# Altium project INTEGRATION ! Omega Blade PCB and Schematic.PrjPcb
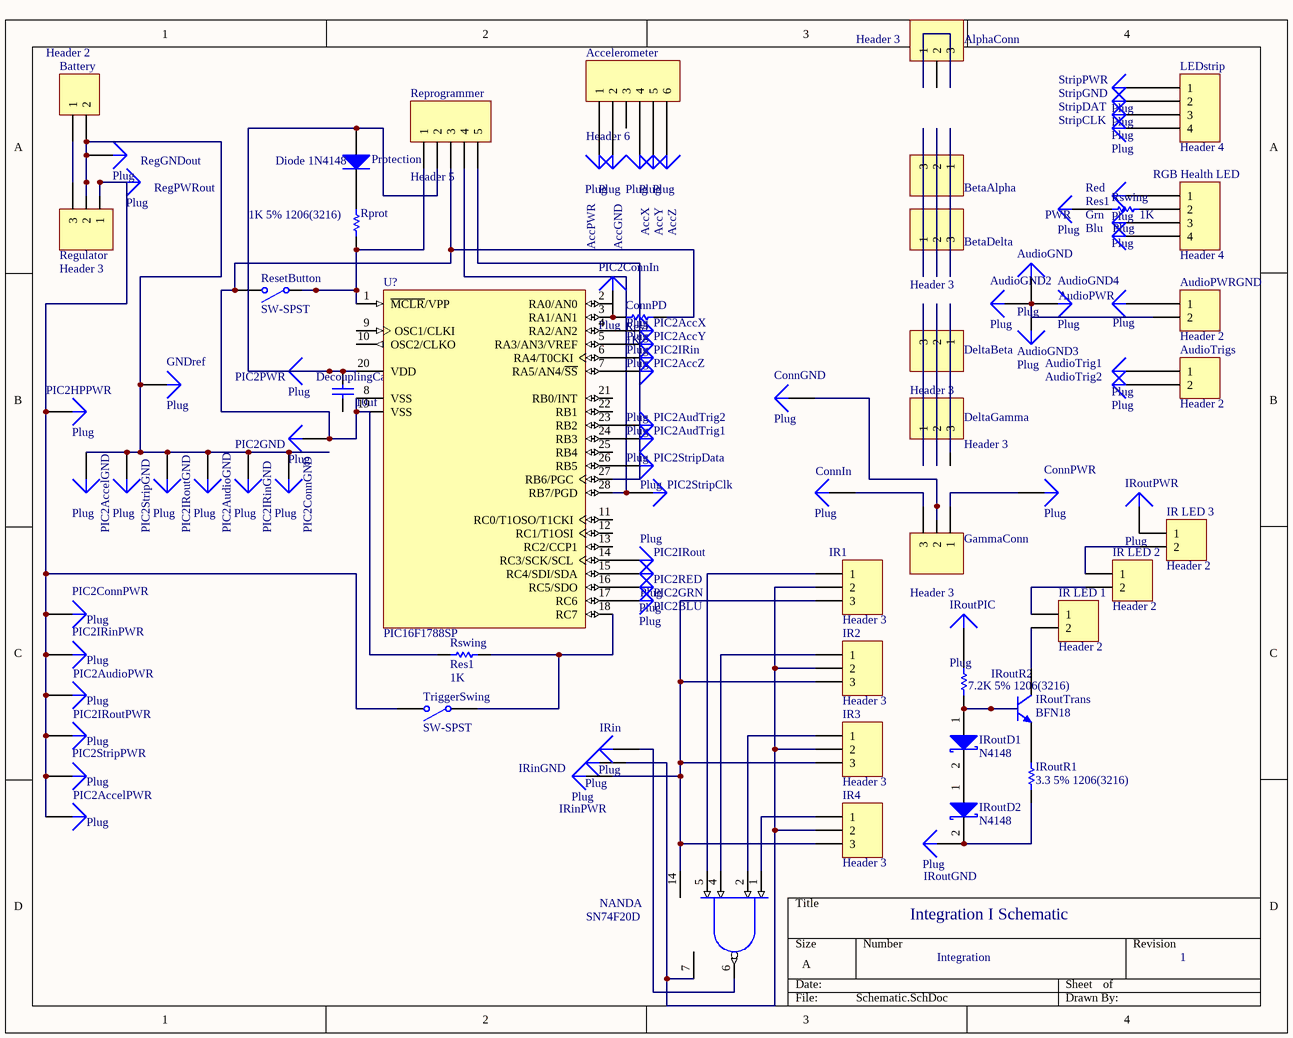
[diagram p0: Schematic.SchDoc]
1 sheet, 96 parts. Net scope: global (net labels, ports and power ports of the same name join across sheets).
Board files: PCB1.PcbDoc, PCB2.PcbDoc

## Sheet Schematic.SchDoc
size A

### Parts
(Parts that share a designator on the sheet are numbered #1, #2 ... from top to bottom, then left to right.)
Accelerometer  Header 6  [HDR1X6]
AccGND  Plug  [PIN1]
AccPWR  Plug  [PIN1]
AccX  Plug  [PIN1]
AccY  Plug  [PIN1]
AccZ  Plug  [PIN1]
AlphaConn  Header 3  [HDR1X3]
AudioGND  Plug  [PIN1]
AudioGND2  Plug  [PIN1]
AudioGND3  Plug  [PIN1]
AudioGND4  Plug  [PIN1]
AudioPWR  Plug  [PIN1]
AudioPWRGND  Header 2  [HDR1X2]
AudioTrig1  Plug  [PIN1]
AudioTrig2  Plug  [PIN1]
AudioTrigs  Header 2  [HDR1X2]
Battery  Header 2  [HDR1X2]
BetaAlpha  Header 3  [HDR1X3]
BetaDelta  Header 3  [HDR1X3]
Blu  Plug  [PIN1]
ConnGND  Plug  [PIN1]
ConnIn  Plug  [PIN1]
ConnPD  Res1  value 1K  [AXIAL-0.3]
ConnPWR  Plug  [PIN1]
DecouplingCap  10uf  [CAPC0805(2012)75_L]
DeltaBeta  Header 3  [HDR1X3]
DeltaGamma  Header 3  [HDR1X3]
GammaConn  Header 3  [HDR1X3]
GNDref  Plug  [PIN1]
Grn  Plug  [PIN1]
IR1  Header 3  [HDR1X3]
IR2  Header 3  [HDR1X3]
IR3  Header 3  [HDR1X3]
IR4  Header 3  [HDR1X3]
IR_LED_1  Header 2  [HDR1X2]
IR_LED_2  Header 2  [HDR1X2]
IR_LED_3  Header 2  [HDR1X2]
IRin  Plug  [PIN1]
IRinGND  Plug  [PIN1]
IRinPWR  Plug  [PIN1]
IRoutD1  N4148  [DIOD-SOD323-2_V]
IRoutD2  N4148  [DIOD-SOD323-2_V]
IRoutGND  Plug  [PIN1]
IRoutPIC  Plug  [PIN1]
IRoutPWR  Plug  [PIN1]
IRoutR1  3.3 5% 1206(3216)  [RESC1206(3216)_N]
IRoutR2  7.2K 5% 1206(3216)  [RESC1206(3216)_N]
IRoutTrans  BFN18  [INF-SOT89_SC-62_M]
LEDstrip  Header 4  [HDR1X4]
NAND  SN74F20D  [D014_M]  (part A of 2)
PIC2AccelGND  Plug  [PIN1]
PIC2AccelPWR  Plug  [PIN1]
PIC2AccX  Plug  [PIN1]
PIC2AccY  Plug  [PIN1]
PIC2AccZ  Plug  [PIN1]
PIC2AudioGND  Plug  [PIN1]
PIC2AudioPWR  Plug  [PIN1]
PIC2AudTrig1  Plug  [PIN1]
PIC2AudTrig2  Plug  [PIN1]
PIC2BLU  Plug  [PIN1]
PIC2ConnGND  Plug  [PIN1]
PIC2ConnIn  Plug  [PIN1]
PIC2ConnPWR  Plug  [PIN1]
PIC2GND  Plug  [PIN1]
PIC2GRN  Plug  [PIN1]
PIC2HPPWR  Plug  [PIN1]
PIC2IRin  Plug  [PIN1]
PIC2IRinGND  Plug  [PIN1]
PIC2IRinPWR  Plug  [PIN1]
PIC2IRout  Plug  [PIN1]
PIC2IRoutGND  Plug  [PIN1]
PIC2IRoutPWR  Plug  [PIN1]
PIC2PWR  Plug  [PIN1]
PIC2RED  Plug  [PIN1]
PIC2StripClk  Plug  [PIN1]
PIC2StripData  Plug  [PIN1]
PIC2StripGND  Plug  [PIN1]
PIC2StripPWR  Plug  [PIN1]
Protection  Diode 1N4148  [DO-35]
PWR  Plug  [PIN1]
Red  Plug  [PIN1]
RegGNDout  Plug  [PIN1]
RegPWRout  Plug  [PIN1]
Regulator  Header 3  [HDR1X3]
Reprogrammer  Header 5  [HDR1X5]
ResetButton  SW-SPST  [SPST-2]
RGB_Health_LED  Header 4  [HDR1X4]
Rprot  1K 5% 1206(3216)  [RESC1206(3216)_N]
Rswing#1  Res1  value 1K  [AXIAL-0.3]
Rswing#2  Res1  value 1K  [AXIAL-0.3]
StripCLK  Plug  [PIN1]
StripDAT  Plug  [PIN1]
StripGND  Plug  [PIN1]
StripPWR  Plug  [PIN1]
TriggerSwing  SW-SPST  [SPST-2]
U?  PIC16F1788SP  [SPDIP300-SP28]

### Nets
GND: IR1.2 IR2.2 IR3.2 IR4.2 IRinGND.1 NAND.7(GND)
VCC: IR1.3 IR2.3 IR3.3 IR4.3 IRinPWR.1 NAND.14(VCC)
NetAccelerometer_1: Accelerometer.1 AccPWR.1
NetAccelerometer_2: Accelerometer.2 AccGND.1
NetAccelerometer_4: Accelerometer.4 AccX.1
NetAccelerometer_5: Accelerometer.5 AccY.1
NetAccelerometer_6: Accelerometer.6 AccZ.1
NetAlphaConn_1: AlphaConn.1 AlphaConn.3
NetAudioGND_1: AudioGND.1 AudioGND2.1 AudioGND3.1 AudioGND4.1 AudioPWRGND.2
NetAudioPWR_1: AudioPWR.1 AudioPWRGND.1
NetAudioTrig1_1: AudioTrig1.1 AudioTrigs.1
NetAudioTrig2_1: AudioTrig2.1 AudioTrigs.2
NetBattery_1: Battery.1 Regulator.3
NetBattery_2: Battery.2 GNDref.1 PIC2AccelGND.1 PIC2AudioGND.1 PIC2ConnGND.1 PIC2IRinGND.1 PIC2IRoutGND.1 PIC2StripGND.1 RegGNDout.1 Regulator.2
NetBetaAlpha_1: BetaAlpha.1 BetaDelta.3
NetBetaAlpha_2: BetaAlpha.2 BetaDelta.2
NetBetaAlpha_3: BetaAlpha.3 BetaDelta.1
NetBlu_1: Blu.1 RGB_Health_LED.4
NetConnGND_1: ConnGND.1 GammaConn.2
NetConnIn_1: ConnIn.1 GammaConn.3
NetConnPD_1: ConnPD.1 PIC2GND.1 Reprogrammer.3 ResetButton.2(NO) Rswing#2.2 U?.8(VSS) U?.19(VSS)
NetConnPD_2: ConnPD.2 PIC2ConnIn.1 U?.3(RA1/AN1)
NetConnPWR_1: ConnPWR.1 GammaConn.1
NetDecouplingCap_1: DecouplingCap.1 PIC2PWR.1 Protection.1(A) Reprogrammer.2 U?.20(VDD)
NetDeltaBeta_2: DeltaBeta.2 DeltaGamma.2
NetDeltaBeta_3: DeltaBeta.3 DeltaGamma.1
NetGrn_1: Grn.1 RGB_Health_LED.3
NetIR1_1: IR1.1 NAND.5(D)
NetIR2_1: IR2.1 NAND.4(C)
NetIR3_1: IR3.1 NAND.2(B)
NetIR4_1: IR4.1 NAND.1(A)
NetIR_LED_1_1: IR_LED_1.1 IR_LED_2.2
NetIR_LED_1_2: IR_LED_1.2 IRoutTrans.2(C)
NetIR_LED_2_1: IR_LED_2.1 IR_LED_3.2
NetIR_LED_3_1: IR_LED_3.1 IRoutPWR.1
NetIRin_1: IRin.1 NAND.6(Y)
NetIRoutD1_1: IRoutD1.1(A) IRoutR2.1 IRoutTrans.1(B)
NetIRoutD1_2: IRoutD1.2(K) IRoutD2.1(A)
NetIRoutD2_2: IRoutD2.2(K) IRoutGND.1 IRoutR1.1
NetIRoutPIC_1: IRoutPIC.1 IRoutR2.2
NetIRoutR1_2: IRoutR1.2 IRoutTrans.3(E)
NetLEDstrip_1: LEDstrip.1 StripPWR.1
NetLEDstrip_2: LEDstrip.2 StripGND.1
NetLEDstrip_3: LEDstrip.3 StripDAT.1
NetLEDstrip_4: LEDstrip.4 StripCLK.1
NetPIC2AccelPWR_1: PIC2AccelPWR.1 PIC2AudioPWR.1 PIC2ConnPWR.1 PIC2HPPWR.1 PIC2IRinPWR.1 PIC2IRoutPWR.1 PIC2StripPWR.1 RegPWRout.1 Regulator.1 TriggerSwing.2(NO)
NetPIC2AccX_1: PIC2AccX.1 U?.4(RA2/AN2)
NetPIC2AccY_1: PIC2AccY.1 U?.5(RA3/AN3/VREF)
NetPIC2AccZ_1: PIC2AccZ.1 U?.7(RA5/AN4/~{SS})
NetPIC2AudTrig1_1: PIC2AudTrig1.1 U?.24(RB3)
NetPIC2AudTrig2_1: PIC2AudTrig2.1 U?.23(RB2)
NetPIC2BLU_1: PIC2BLU.1 U?.17(RC6)
NetPIC2GRN_1: PIC2GRN.1 U?.16(RC5/SDO)
NetPIC2IRin_1: PIC2IRin.1 U?.6(RA4/T0CKI)
NetPIC2IRout_1: PIC2IRout.1 U?.14(RC3/SCK/SCL)
NetPIC2RED_1: PIC2RED.1 U?.15(RC4/SDI/SDA)
NetPIC2StripClk_1: PIC2StripClk.1 Reprogrammer.4 U?.28(RB7/PGD)
NetPIC2StripData_1: PIC2StripData.1 U?.26(RB5)
NetProtection_2: Protection.2(K) Rprot.2
NetPWR_1: PWR.1 Rswing#1.2
NetRed_1: Red.1 RGB_Health_LED.1
NetReprogrammer_1: Reprogrammer.1 ResetButton.1(COMMON) Rprot.1 U?.1(~{MCLR}/VPP)
NetReprogrammer_5: Reprogrammer.5 U?.27(RB6/PGC)
NetRGB_Health_LED_2: RGB_Health_LED.2 Rswing#1.1
NetRswing#2_1: Rswing#2.1 TriggerSwing.1(COMMON) U?.18(RC7)

Not connected (* = marked no-connect by the designer): Accelerometer 3; AlphaConn 2; DecouplingCap 2; DeltaBeta 1; DeltaGamma 3; U? 2(RA0/AN0) 9(OSC1/CLKI) 10(OSC2/CLKO) 11(RC0/T1OSO/T1CKI) 12(RC1/T1OSI) 13(RC2/CCP1) 21(RB0/INT) 22(RB1) 25(RB4)

### Notes on the sheet
- Integration I Schematic
- Integration
- 1

### Library data of the parts
Accelerometer = Header 6: Header, 6-Pin; LatestRevisionDate: 17-Jul-2002; LatestRevisionNote: Re-released for DXP Platform.; Publisher: Altium Limited
AlphaConn BetaAlpha BetaDelta DeltaBeta DeltaGamma GammaConn IR1-IR4 Regulator = Header 3: Header, 3-Pin; LatestRevisionDate: 17-Jul-2002; LatestRevisionNote: Re-released for DXP Platform.; Publisher: Altium Limited
AudioPWRGND AudioTrigs Battery IR_LED_1-IR_LED_3 = Header 2: Header, 2-Pin; LatestRevisionDate: 17-Jul-2002; LatestRevisionNote: Re-released for DXP Platform.; Publisher: Altium Limited
ConnPD Rswing#1 Rswing#2 = Res1: Resistor; Published: 8-Jun-2000; LatestRevisionDate: 17-Jul-2002; LatestRevisionNote: Re-released for DXP Platform.; PackageReference: AXIAL-0.3; Publisher: Altium Limited; PackageDescription: Axial Device, Thru-Hole; 2 Leads; 0.3 in Pin Spacing
DecouplingCap = CMP-1036-01219-1: CAP 22pF 16V Â±5% 0805 (2012 Metric) Thickness 0.75mm SMD; Case-Metric: 2012; Case-EIA: 0805; Technology: SMT; Max Thickness: 0.75 mm; Value: 22pF; Tolerance: Â±5%; Rated Voltage: 16 V
IRoutD1 IRoutD2 = CMP-0303-00001-1: Schottky Diode, 400mA; PartNumber: ZHCS400; Manufacturer: Diodes Inc; Reverse Voltage: 40 V; Power Dissipation: 250 mW; Reverse Current: 40 uA@Vr=30 V; Packing Type: Tape and Reel; Forward Voltage: 425 mV@If=400 mA; ComponentLink3URL: http://www.diodes.com/datasheets/ap02002.pdf; Moisture Sensitivity Level: 1; ComponentLink2URL: http://www.diodes.com/datasheets/ZHCS400.pdf; PackageDescription: 2-Pin SMT Diode, 1.7 x 1.3 mm Body; ComponentLink2Description: Datasheet; PackageReference: SOD323; ComponentLink1Description: Manufacturer URL; Mounting Technology: Surface Mount; DatasheetVersion: Rev. 8-2, 03/2012; ComponentLink1URL: http://www.diodes.com/; Storage Temperature: -55 to 150 degC; ComponentLink3Description: Package Specification; PackageVersion: Rev. 73
IRoutR1 IRoutR2 Rprot = CMP-1014-00074-1: 1K 0.25W 5% 1206 (3216 Metric)  SMD; Value: 1000.00 Ohm; Case-Metric: 3216; Case-EIA: 1206; Tolerance: 5 %; Power: 0.25 W; Technology: SMT
IRoutTrans = CMP-1197-00012-1: NPN Silicon High-Voltage Transistor, 300 V VCEO, 30 mA IC, SOT89, Reel, Green; Manufacturer: Infineon; ICM (max): 500Â mA; ICBO (max): 100Â nA; VEBO (max): 5Â V; VCE: 10Â V; VCBO (max): 300Â V; hFE (min): 30; IC (max): 30Â mA; Green: TRUE; fT (typ): 70Â MHz; ComponentLink3URL: http://www.infineon.com/dgdl/SOT89-Package_Overview.pdf?folderId=db3a30431936bc4b01195371b8363cff&fileId=db3a30431936bc4b0119537ed61d3d22; DatasheetVersion: Rev. 1.0; ComponentLink2URL: http://www.infineon.com/dgdl/bfn18.pdf?folderId=db3a30431441fb5d011449af3ad90232&fileId=db3a30431441fb5d011449b188060234; ComponentLink1Description: Manufacturer URL; VCE (max): 10Â V; Mounting Technology: Surface Mount; ComponentLink1URL: http://www.infineon.com/; Packing: Reel; Polarity: NPN; PackageDescription: 3-Pin Small Outline Transistor Package, 4.5 x 2.5 mm Body, 1.5 mm Pitch; ComponentLink3Description: Package Specification; ComponentLink2Description: Datasheet; PartNumber: BFN18; PackageVersion: Apr-08; PackageReference: SOT89 (SC-62); IC: 30Â mA; VCEO (max): 300Â V
LEDstrip RGB_Health_LED = Header 4: Header, 4-Pin; LatestRevisionDate: 17-Jul-2002; LatestRevisionNote: Re-released for DXP Platform.; Publisher: Altium Limited
NAND = SN74F20D: Dual 4-Input Positive-NAND Gate; Note: Pins 3 and 11 are NC & not drawn.; Published: 8-Jun-2000; LatestRevisionDate: 13-Apr-2006; LatestRevisionNote: IPC-7351 Footprint Added.; DatasheetVersion: Oct-1993; PackageVersion: Jan-1998; PackageReference: D014; Publisher: Altium Limited; PackageDescription: 14-Pin Small Outline Integrated Circuit 1.27 mm Pitch; Code_IPC: SOIC127P600-14; ComponentLink1Description: Manufacturer Link; ComponentLink1URL: http://www.ti.com/; ComponentLink2Description: Datasheet; ComponentLink2URL: http://www-s.ti.com/sc/ds/SN54F20.pdf
Protection = Diode 1N4148: High Conductance Fast Diode; Published: 8-Jun-2000; LatestRevisionDate: 17-Jul-2002; LatestRevisionNote: Re-released for DXP Platform.; DatasheetVersion: 1997; PackageReference: DO-35; Publisher: Altium Limited; PackageDescription: Diode, Axial; Body 3.8 x 1.9 mm (LxDia. max), Lead Dia. 0.53 mm (max); Code_JEDEC: DO-204-AH; ComponentLink1Description: Manufacturer Link; ComponentLink1URL: http://www.fairchildsemi.com/; ComponentLink2Description: Datasheet; ComponentLink2URL: http://www.fairchildsemi.com/ds/1N%2F1N4148.pdf
Reprogrammer = Header 5: Header, 5-Pin; LatestRevisionDate: 17-Jul-2002; LatestRevisionNote: Re-released for DXP Platform.; Publisher: Altium Limited
ResetButton TriggerSwing = SW-SPST: Single-Pole, Single-Throw Switch; Published: 24-Mar-1999; LatestRevisionDate: 17-Jul-2002; LatestRevisionNote: Re-released for DXP Platform.; PackageReference: SPST-2; Publisher: Altium Limited; PackageDescription: Switch; 2 Leads
U? = PIC16F72-I/SP: 8-Bit CMOS FLASH Microcontroller with A/D Converter, 2K (x14-Bit words) FLASH, 128 Bytes RAM, 28-Pin PDIP 300mil, Standard VDD Range, Industrial Temperature; Published: 11-Oct-2004; LatestRevisionDate: 29-Jan-2009; LatestRevisionNote: Sch. layout revised. 3D Model Removed.; DatasheetVersion: revC, Jan-2007; PackageVersion: revBB, Aug-2009; PackageReference: SPDIP300-SP28; Publisher: Altium Limited; PackageDescription: 28-Lead Skinny Plastic Dual In-Line (SP) - 300 mil Body [SPDIP]; Supplier 1: Digi-Key; Supplier Part Number 1: PIC16F72-I/SP-ND; Supplier 2: Farnell; Supplier Part Number 2: 9760636; ComponentLink1Description: Datasheet; ComponentLink1URL: http://ww1.microchip.com/downloads/en/DeviceDoc/39597C.pdf; ComponentLink2Description: Packaging Specification; ComponentLink2URL: http://www.microchip.com/stellent/groups/techpub_sg/documents/packagingspec/en012702.pdf; ComponentLink3Description: Microchip.com Home; ComponentLink3URL: http://www.microchip.com/
AccGND AccPWR AccX AccY AccZ AudioGND AudioGND2-AudioGND4 AudioPWR AudioTrig1 AudioTrig2 Blu ConnGND ConnIn ConnPWR GNDref Grn IRin IRinGND IRinPWR IRoutGND IRoutPIC IRoutPWR PIC2AccelGND PIC2AccelPWR PIC2AccX PIC2AccY PIC2AccZ PIC2AudioGND PIC2AudioPWR PIC2AudTrig1 PIC2AudTrig2 PIC2BLU PIC2ConnGND PIC2ConnIn PIC2ConnPWR PIC2GND PIC2GRN PIC2HPPWR PIC2IRin PIC2IRinGND PIC2IRinPWR PIC2IRout PIC2IRoutGND PIC2IRoutPWR PIC2PWR PIC2RED PIC2StripClk PIC2StripData PIC2StripGND PIC2StripPWR PWR Red RegGNDout RegPWRout StripCLK StripDAT StripGND StripPWR = Plug: LatestRevisionDate: 17-Jul-2002; LatestRevisionNote: Re-released for DXP Platform.; Publisher: Altium Limited